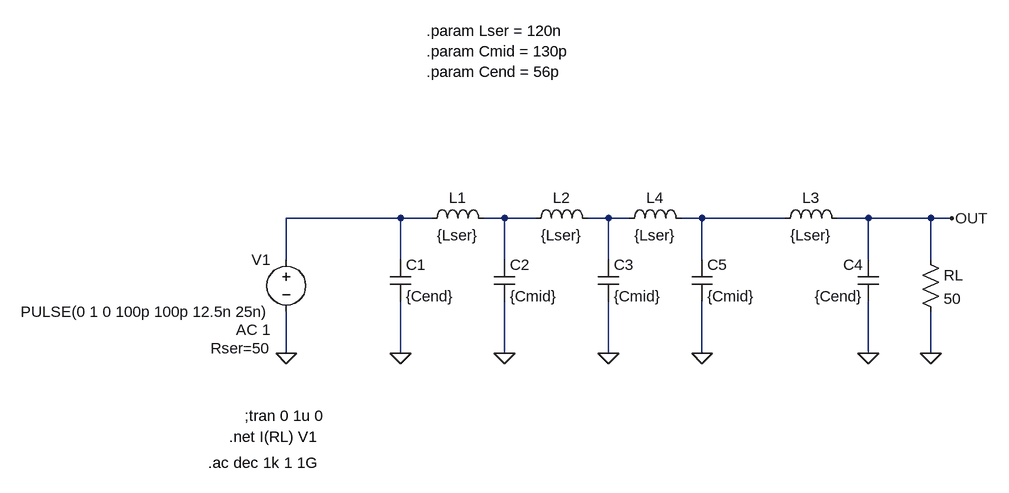
[diagram p0: schematic 80MHz_LPF.asc]
80MHz_LPF.asc, the LTspice schematic file:
Version 4
SHEET 1 1588 680
WIRE 672 0 496 0
WIRE 720 0 672 0
WIRE 832 0 800 0
WIRE 880 0 832 0
WIRE 992 0 960 0
WIRE 1024 0 992 0
WIRE 1136 0 1104 0
WIRE 1264 0 1136 0
WIRE 1392 0 1344 0
WIRE 1488 0 1392 0
WIRE 1520 0 1488 0
WIRE 496 64 496 0
WIRE 672 64 672 0
WIRE 832 64 832 0
WIRE 992 64 992 0
WIRE 1136 64 1136 0
WIRE 1392 64 1392 0
WIRE 1488 64 1488 0
WIRE 496 208 496 144
WIRE 672 208 672 128
WIRE 832 208 832 128
WIRE 992 208 992 128
WIRE 1136 208 1136 128
WIRE 1392 208 1392 128
WIRE 1488 208 1488 144
FLAG 496 208 0
FLAG 672 208 0
FLAG 832 208 0
FLAG 1392 208 0
FLAG 1136 208 0
FLAG 992 208 0
FLAG 1520 0 OUT
FLAG 1488 208 0
SYMBOL voltage 496 48 M0
WINDOW 123 24 124 Left 2
WINDOW 39 24 152 Left 2
SYMATTR Value2 AC 1
SYMATTR SpiceLine Rser=50
SYMATTR InstName V1
SYMATTR Value PULSE(0 1 0 100p 100p 12.5n 25n)
SYMBOL ind 704 16 R270
WINDOW 0 32 56 VTop 2
WINDOW 3 5 56 VBottom 2
SYMATTR InstName L1
SYMATTR Value {Lser}
SYMBOL cap 656 64 R0
SYMATTR InstName C1
SYMATTR Value {Cend}
SYMBOL cap 816 64 R0
SYMATTR InstName C2
SYMATTR Value {Cmid}
SYMBOL ind 864 16 R270
WINDOW 0 32 56 VTop 2
WINDOW 3 5 56 VBottom 2
SYMATTR InstName L2
SYMATTR Value {Lser}
SYMBOL cap 976 64 R0
SYMATTR InstName C3
SYMATTR Value {Cmid}
SYMBOL ind 1360 16 M270
WINDOW 0 32 56 VTop 2
WINDOW 3 5 56 VBottom 2
SYMATTR InstName L3
SYMATTR Value {Lser}
SYMBOL cap 1408 64 M0
SYMATTR InstName C4
SYMATTR Value {Cend}
SYMBOL cap 1120 64 R0
SYMATTR InstName C5
SYMATTR Value {Cmid}
SYMBOL ind 1120 16 M270
WINDOW 0 32 56 VTop 2
WINDOW 3 5 56 VBottom 2
SYMATTR InstName L4
SYMATTR Value {Lser}
SYMBOL res 1472 48 R0
SYMATTR InstName RL
SYMATTR Value 50
TEXT 432 304 Left 2 !;tran 0 1u 0
TEXT 408 336 Left 2 !.net I(RL) V1
TEXT 376 376 Left 2 !.ac dec 1k 1 1G
TEXT 712 -288 Left 2 !.param Lser = 120n\n.param Cmid = 130p\n.param Cend = 56p

The netlist it stands for:
* 80MHz_LPF.asc
V1 N001 0 PULSE(0 1 0 100p 100p 12.5n 25n) AC 1 Rser=50
L1 N001 N002 {Lser}
C1 N001 0 {Cend}
C2 N002 0 {Cmid}
L2 N002 N003 {Lser}
C3 N003 0 {Cmid}
L3 OUT N004 {Lser}
C4 OUT 0 {Cend}
C5 N004 0 {Cmid}
L4 N004 N003 {Lser}
RL OUT 0 50
;tran 0 1u 0
.net I(RL) V1
.ac dec 1k 1 1G
.param Lser = 120n
.param Cmid = 130p
.param Cend = 56p
.backanno
.end